# Altium schematic sheet Config_Generate_FPGA.SchDoc
size 420 x 297 mm
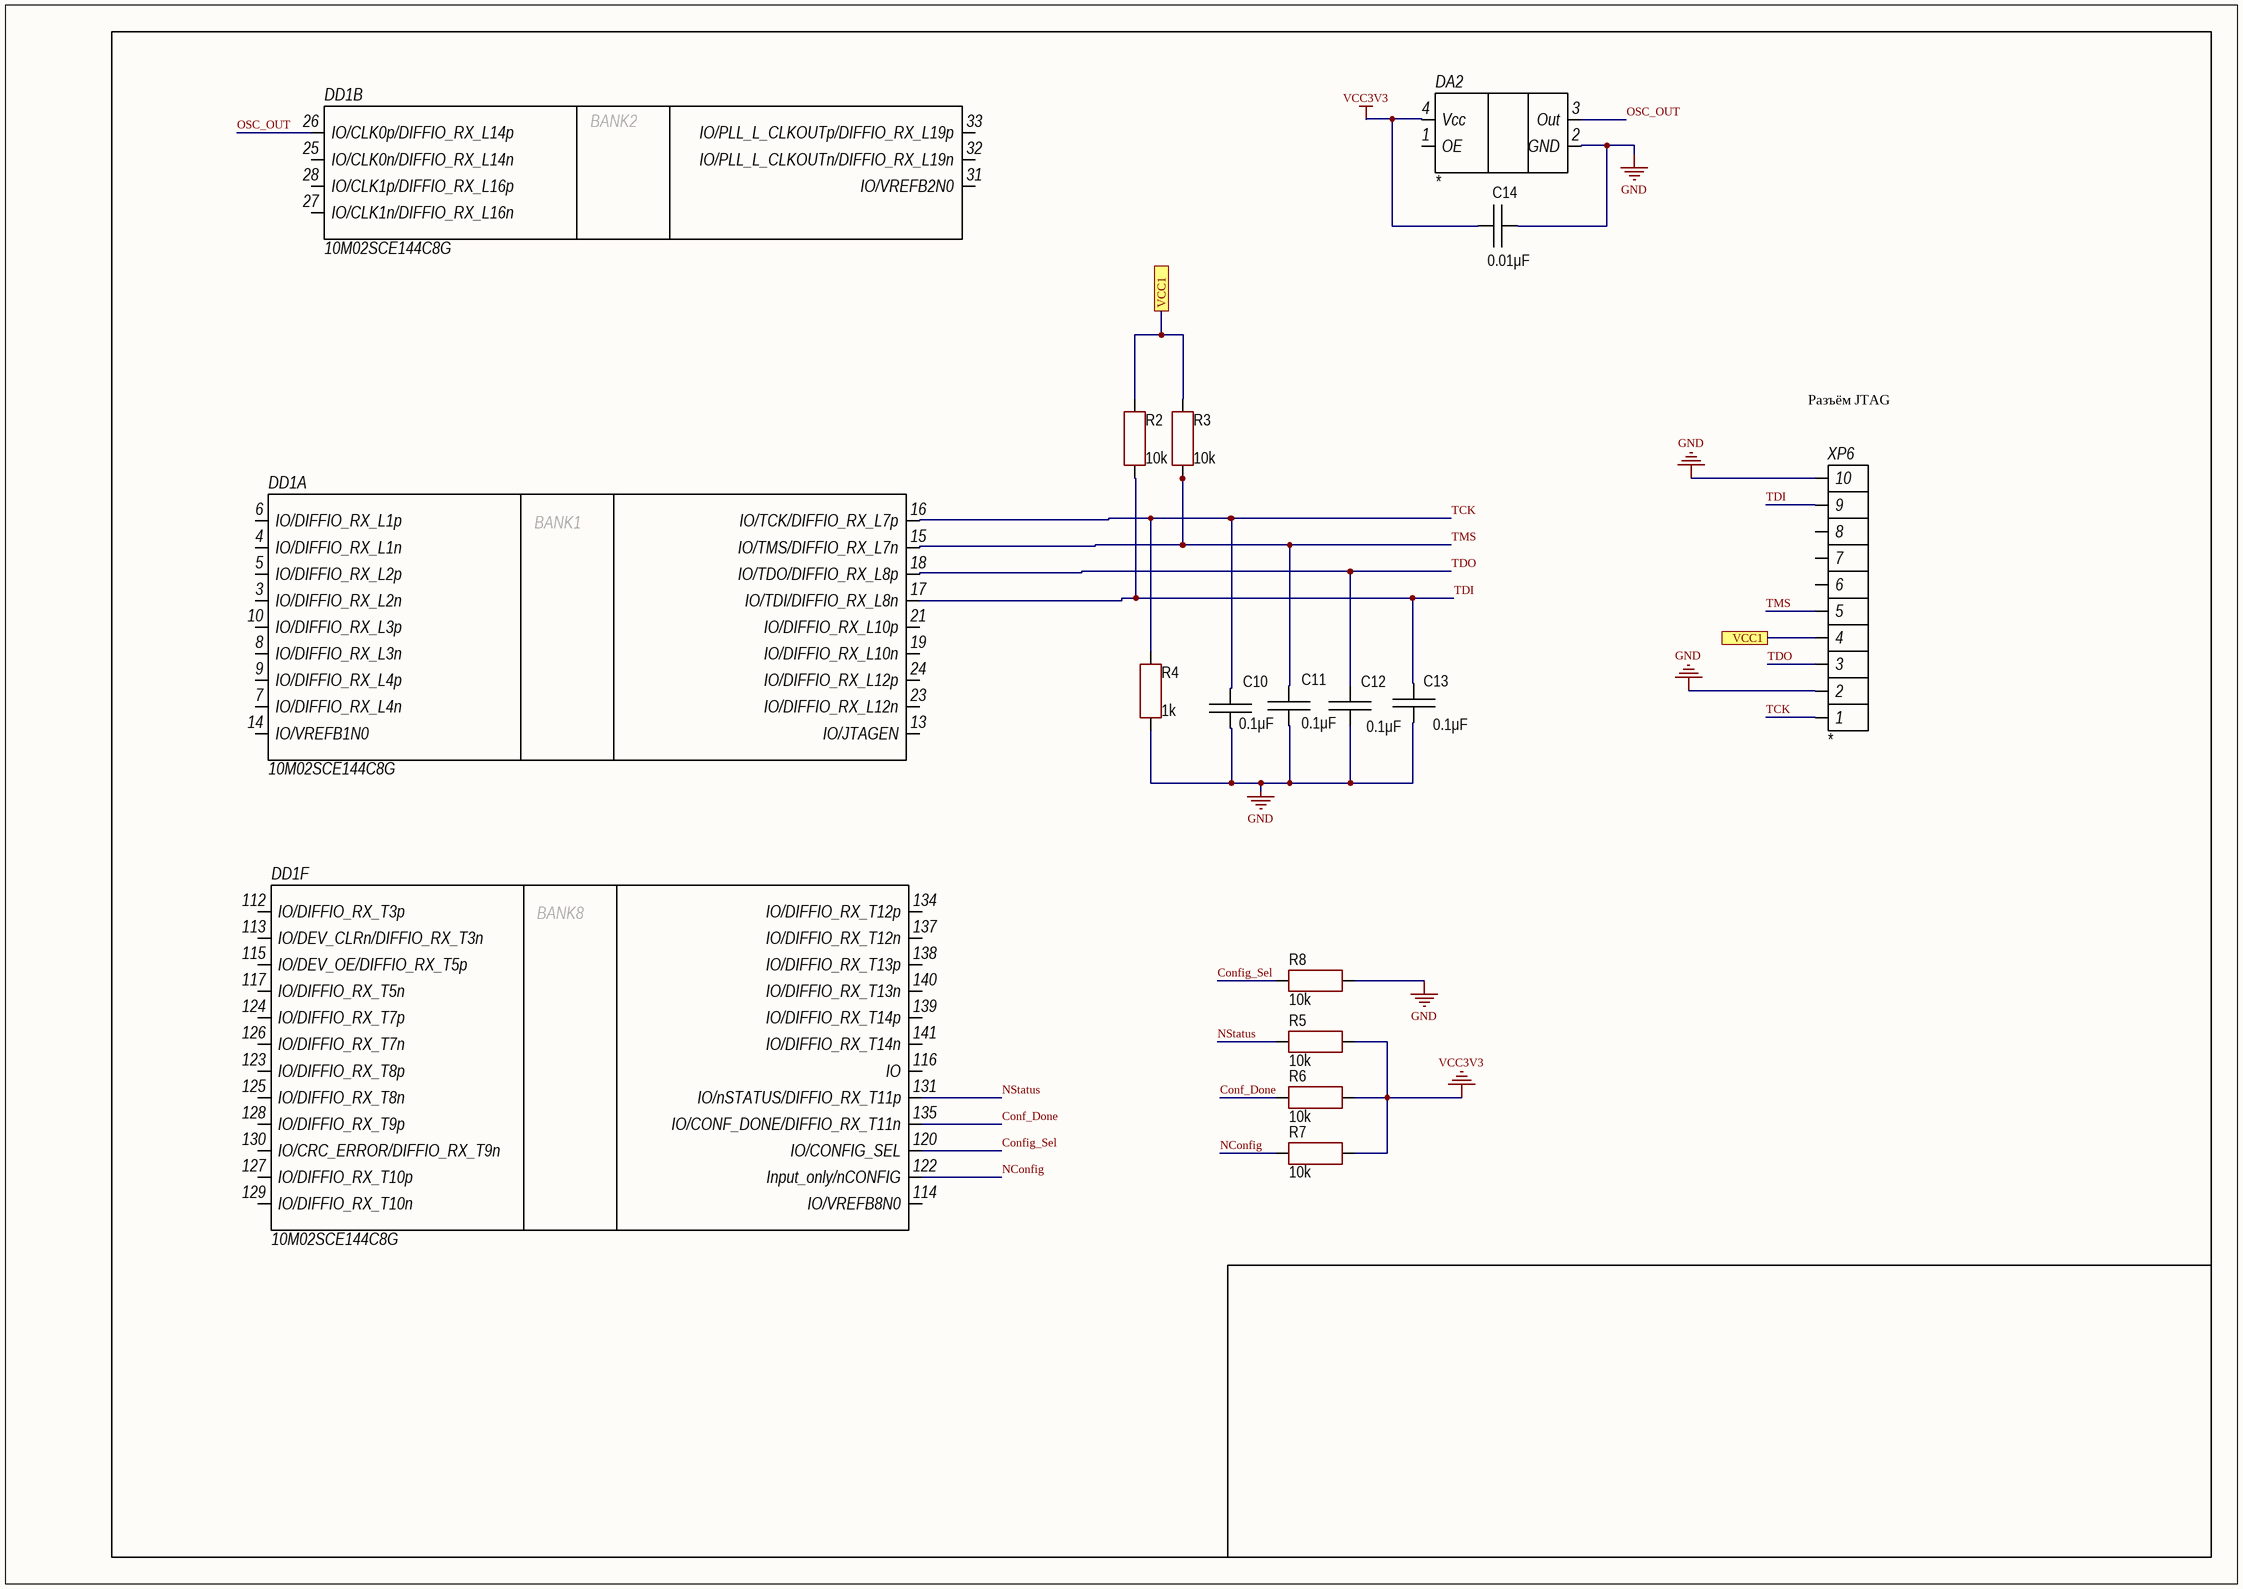
[diagram p0: Config_Generate_FPGA.SchDoc]

## Parts
C10  value 0.1μF  [CAP: 0805]
C11  value 0.1μF  [CAP: 0805]
C12  value 0.1μF  [CAP: 0805]
C13  value 0.1μF  [CAP: 0805]
C14  value 0.01μF  [CAP: 0805]
DA2  *  [4-SMD, NO LEAD]
DD1  10M02SCE144C8G  [144-Lead EQFP]  (parts A,B,F of 7)
R2  value 10k  [RES: 0805]
R3  value 10k  [RES: 0805]
R4  value 1k  [RES: 0805]
R5  value 10k  [RES: 0805]
R6  value 10k  [RES: 0805]
R7  value 10k  [RES: 0805]
R8  value 10k  [RES: 0805]
XP6  *  [IDC-10MS]

## Ports
VCC1

## Nets
GND: C10.1 C11.1 C12.1 C13.1 C14.1 DA2.2(GND) R4.1 R8.1 XP6.2 XP6.10
VCC3V3: C14.2 DA2.4(Vcc) R5.1 R6.1 R7.1
Conf_Done: DD1.135(IO/CONF_DONE/DIFFIO_RX_T11n) R6.2
Config_Sel: DD1.120(IO/CONFIG_SEL) R8.2
NConfig: DD1.122(Input_only/nCONFIG) R7.2
NStatus: DD1.131(IO/nSTATUS/DIFFIO_RX_T11p) R5.2
OSC_OUT: DA2.3(Out) DD1.26(IO/CLK0p/DIFFIO_RX_L14p)
TCK: C10.2 DD1.16(IO/TCK/DIFFIO_RX_L7p) R4.2 XP6.1
TDI: C13.2 DD1.17(IO/TDI/DIFFIO_RX_L8n) R2.1 XP6.9
TDO: C12.2 DD1.18(IO/TDO/DIFFIO_RX_L8p) XP6.3
TMS: C11.2 DD1.15(IO/TMS/DIFFIO_RX_L7n) R3.1 XP6.5
VCC1: R2.2 R3.2 XP6.4 ; port VCC1

Not connected (* = marked no-connect by the designer): DA2 1(OE); DD1 3(IO/DIFFIO_RX_L2n) 4(IO/DIFFIO_RX_L1n) 5(IO/DIFFIO_RX_L2p) 6(IO/DIFFIO_RX_L1p) 7(IO/DIFFIO_RX_L4n) 8(IO/DIFFIO_RX_L3n) 9(IO/DIFFIO_RX_L4p) 10(IO/DIFFIO_RX_L3p) 13(IO/JTAGEN) 14(IO/VREFB1N0) 19(IO/DIFFIO_RX_L10n) 21(IO/DIFFIO_RX_L10p) 23(IO/DIFFIO_RX_L12n) 24(IO/DIFFIO_RX_L12p) 25(IO/CLK0n/DIFFIO_RX_L14n) 27(IO/CLK1n/DIFFIO_RX_L16n) 28(IO/CLK1p/DIFFIO_RX_L16p) 31(IO/VREFB2N0) 32(IO/PLL_L_CLKOUTn/DIFFIO_RX_L19n) 33(IO/PLL_L_CLKOUTp/DIFFIO_RX_L19p) 112(IO/DIFFIO_RX_T3p) 113(IO/DEV_CLRn/DIFFIO_RX_T3n) 114(IO/VREFB8N0) 115(IO/DEV_OE/DIFFIO_RX_T5p) 116(IO) 117(IO/DIFFIO_RX_T5n) 123(IO/DIFFIO_RX_T8p) 124(IO/DIFFIO_RX_T7p) 125(IO/DIFFIO_RX_T8n) 126(IO/DIFFIO_RX_T7n) 127(IO/DIFFIO_RX_T10p) 128(IO/DIFFIO_RX_T9p) 129(IO/DIFFIO_RX_T10n) 130(IO/CRC_ERROR/DIFFIO_RX_T9n) 134(IO/DIFFIO_RX_T12p) 137(IO/DIFFIO_RX_T12n) 138(IO/DIFFIO_RX_T13p) 139(IO/DIFFIO_RX_T14p) 140(IO/DIFFIO_RX_T13n) 141(IO/DIFFIO_RX_T14n); XP6 6 7 8

## Notes on the sheet
- Разъём JTAG
- (in symbol 10M02SCE144C8G, part A) BANK1
- (in symbol 10M02SCE144C8G, part B) BANK2
- (in symbol 10M02SCE144C8G, part F) BANK8

## Library data of the parts
C10-C13 = Ceramic_0805: ValueManufacturerPartNumber: Ceramic capacitor, 0.1μF, X7R, , 16V, 0805,; TypeCapacitor: Ceramic capacitor; TypeDielectric: X7R; Voltage: 16V; Package: 0805
C14 = Ceramic_0805: ValueManufacturerPartNumber: Ceramic capacitor, 0.01μF, X7R, , , 0805,; TypeCapacitor: Ceramic capacitor; TypeDielectric: X7R; Package: 0805
DA2 = SG 8002: Oscillator; Manufacturer: EPSON; HelpUrl: https://support.epson.biz/td/api/doc_check.php?dl=brief_SG-8002CA&lang=en; PartNumber: *; Value: *
DD1 = 10M02SCE144C8G: MAX10 FPGA; Manufacturer: Intel; Value: 10M02SCE144C8G; HelpUrl: https://www.digikey.com/product-detail/en/intel/10M02SCE144C8G/544-3098-ND/5284822; PartNumber: 10M02SCE144C8G
R2 R3 R5-R8 = Resistor_0805: ValueManufacturerPartNumber: Resistor film, 10k, , 0805, ,; TypeResistor: Resistor film; Package: 0805
R4 = Resistor_0805: ValueManufacturerPartNumber: Resistor film, 1k, , 0805, ,; TypeResistor: Resistor film; Package: 0805
XP6 = Connector 10-pin: Connector; Manufacturer: *; Value: *